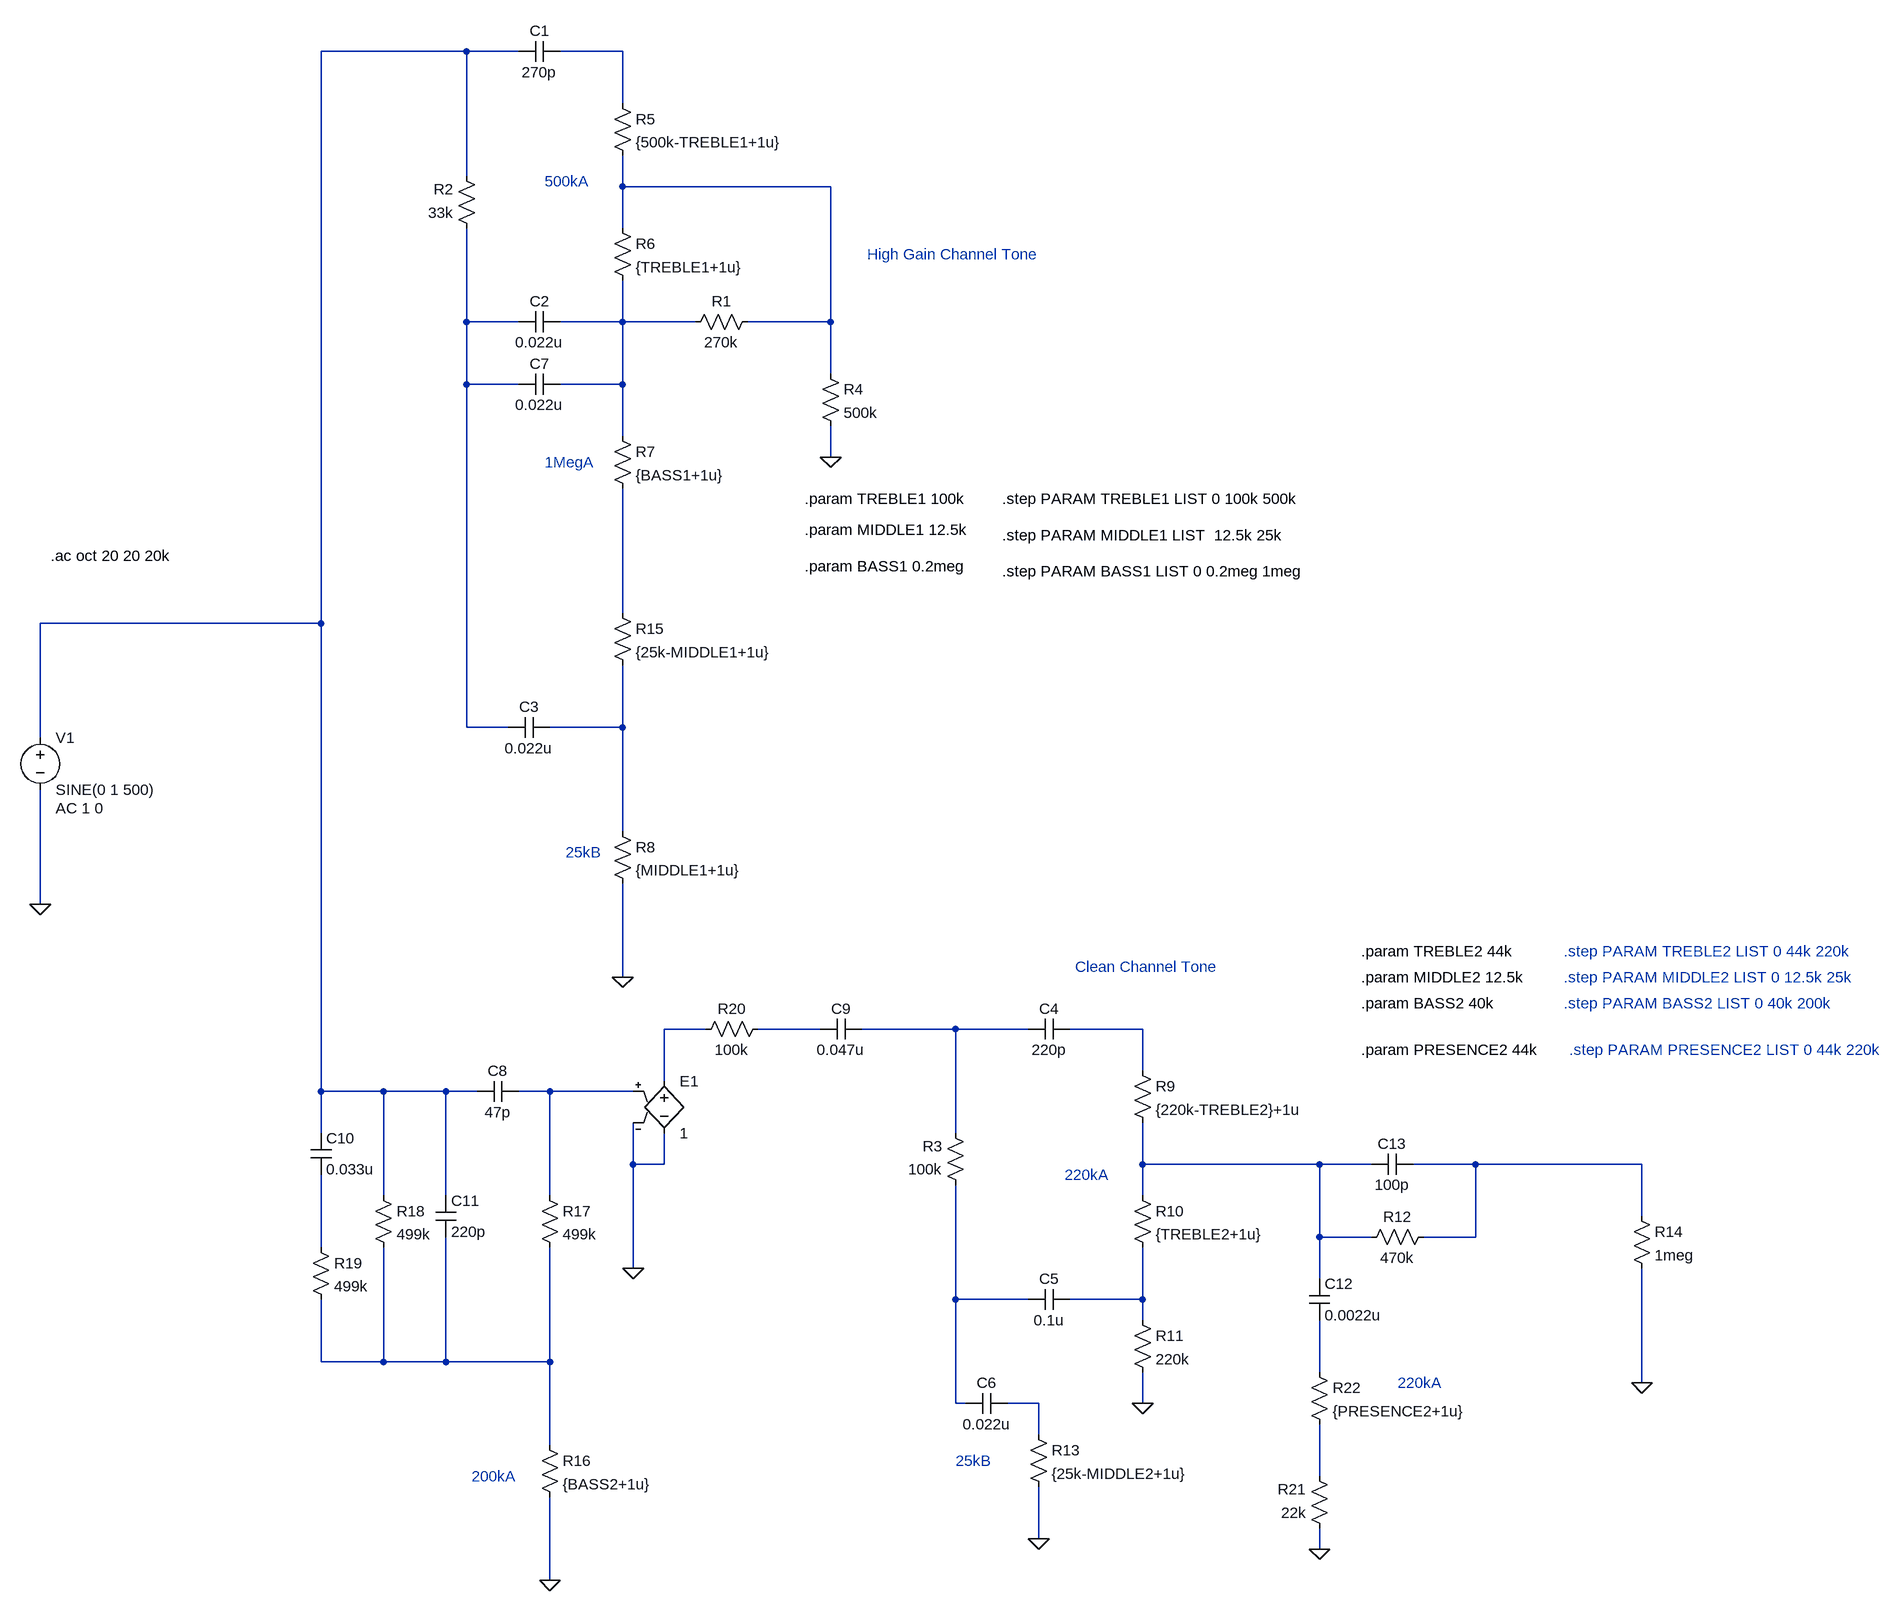
[diagram p0: schematic Bogner Ubershall Tone.asc]
Bogner Ubershall Tone.asc, the LTspice schematic file:
Version 4
SHEET 1 1312 2708
WIRE -1008 -928 -1232 -928
WIRE -928 -928 -1008 -928
WIRE -768 -928 -864 -928
WIRE -768 -848 -768 -928
WIRE -1008 -736 -1008 -928
WIRE -768 -720 -768 -768
WIRE -448 -720 -768 -720
WIRE -768 -656 -768 -720
WIRE -1008 -512 -1008 -656
WIRE -928 -512 -1008 -512
WIRE -768 -512 -768 -576
WIRE -768 -512 -864 -512
WIRE -656 -512 -768 -512
WIRE -448 -512 -448 -720
WIRE -448 -512 -576 -512
WIRE -448 -432 -448 -512
WIRE -1008 -416 -1008 -512
WIRE -928 -416 -1008 -416
WIRE -768 -416 -768 -512
WIRE -768 -416 -864 -416
WIRE -768 -336 -768 -416
WIRE -448 -304 -448 -352
WIRE -768 -64 -768 -256
WIRE -1232 -48 -1232 -928
WIRE -1232 -48 -1664 -48
WIRE -1008 112 -1008 -416
WIRE -944 112 -1008 112
WIRE -768 112 -768 16
WIRE -768 112 -880 112
WIRE -1664 128 -1664 -48
WIRE -768 272 -768 112
WIRE -1664 384 -1664 208
WIRE -768 496 -768 352
WIRE -640 576 -704 576
WIRE -464 576 -560 576
WIRE -256 576 -400 576
WIRE -144 576 -256 576
WIRE 32 576 -80 576
WIRE 32 640 32 576
WIRE -704 656 -704 576
WIRE -1232 672 -1232 -48
WIRE -1136 672 -1232 672
WIRE -1040 672 -1136 672
WIRE -992 672 -1040 672
WIRE -880 672 -928 672
WIRE -752 672 -880 672
WIRE -1232 736 -1232 672
WIRE -256 736 -256 576
WIRE -752 784 -752 720
WIRE -704 784 -704 736
WIRE -704 784 -752 784
WIRE 32 784 32 720
WIRE 304 784 32 784
WIRE 384 784 304 784
WIRE 544 784 448 784
WIRE 800 784 544 784
WIRE -1136 832 -1136 672
WIRE -1040 832 -1040 672
WIRE -880 832 -880 672
WIRE 32 832 32 784
WIRE 800 864 800 784
WIRE 304 896 304 784
WIRE 384 896 304 896
WIRE 544 896 544 784
WIRE 544 896 464 896
WIRE -1232 912 -1232 800
WIRE -752 944 -752 784
WIRE 304 960 304 896
WIRE -256 992 -256 816
WIRE -144 992 -256 992
WIRE 32 992 32 912
WIRE 32 992 -80 992
WIRE 32 1024 32 992
WIRE -1232 1088 -1232 992
WIRE -1136 1088 -1136 912
WIRE -1136 1088 -1232 1088
WIRE -1040 1088 -1040 896
WIRE -1040 1088 -1136 1088
WIRE -880 1088 -880 912
WIRE -880 1088 -1040 1088
WIRE 304 1104 304 1024
WIRE 800 1120 800 944
WIRE -256 1152 -256 992
WIRE -240 1152 -256 1152
WIRE -128 1152 -176 1152
WIRE 32 1152 32 1104
WIRE -128 1200 -128 1152
WIRE -880 1216 -880 1088
WIRE 304 1264 304 1184
WIRE -128 1360 -128 1280
WIRE 304 1376 304 1344
WIRE -880 1424 -880 1296
FLAG -768 496 0
FLAG -128 1360 0
FLAG -1664 384 0
FLAG -448 -304 0
FLAG 800 1120 0
FLAG -880 1424 0
FLAG -752 944 0
FLAG 32 1152 0
FLAG 304 1376 0
SYMBOL res -992 -640 R180
WINDOW 0 36 76 Left 2
WINDOW 3 36 40 Left 2
SYMATTR InstName R2
SYMATTR Value 33k
SYMBOL res -240 832 R180
WINDOW 0 36 76 Left 2
WINDOW 3 36 40 Left 2
SYMATTR InstName R3
SYMATTR Value 100k
SYMBOL res -464 -448 R0
SYMATTR InstName R4
SYMATTR Value 500k
SYMBOL res -784 -864 R0
SYMATTR InstName R5
SYMATTR Value {500k-TREBLE1+1u}
SYMBOL res -784 -672 R0
SYMATTR InstName R6
SYMATTR Value {TREBLE1+1u}
SYMBOL res -784 -352 R0
SYMATTR InstName R7
SYMATTR Value {BASS1+1u}
SYMBOL res -784 256 R0
SYMATTR InstName R8
SYMATTR Value {MIDDLE1+1u}
SYMBOL res 16 624 R0
SYMATTR InstName R9
SYMATTR Value {220k-TREBLE2}+1u
SYMBOL res 16 816 R0
SYMATTR InstName R10
SYMATTR Value {TREBLE2+1u}
SYMBOL res 16 1008 R0
SYMATTR InstName R11
SYMATTR Value 220k
SYMBOL res -144 1184 R0
SYMATTR InstName R13
SYMATTR Value {25k-MIDDLE2+1u}
SYMBOL res 784 848 R0
SYMATTR InstName R14
SYMATTR Value 1meg
SYMBOL voltage -1664 112 R0
WINDOW 123 24 124 Left 2
WINDOW 39 0 0 Left 2
SYMATTR Value2 AC 1 0
SYMATTR InstName V1
SYMATTR Value SINE(0 1 500)
SYMBOL cap -864 -944 R90
WINDOW 0 0 32 VBottom 2
WINDOW 3 32 32 VTop 2
SYMATTR InstName C1
SYMATTR Value 270p
SYMBOL cap -864 -528 R90
WINDOW 0 0 32 VBottom 2
WINDOW 3 32 32 VTop 2
SYMATTR InstName C2
SYMATTR Value 0.022u
SYMBOL cap -880 96 R90
WINDOW 0 0 32 VBottom 2
WINDOW 3 32 32 VTop 2
SYMATTR InstName C3
SYMATTR Value 0.022u
SYMBOL cap -80 560 R90
WINDOW 0 0 32 VBottom 2
WINDOW 3 32 32 VTop 2
SYMATTR InstName C4
SYMATTR Value 220p
SYMBOL cap -80 976 R90
WINDOW 0 0 32 VBottom 2
WINDOW 3 32 32 VTop 2
SYMATTR InstName C5
SYMATTR Value 0.1u
SYMBOL cap -176 1136 R90
WINDOW 0 0 32 VBottom 2
WINDOW 3 32 32 VTop 2
SYMATTR InstName C6
SYMATTR Value 0.022u
SYMBOL cap -864 -432 R90
WINDOW 0 0 32 VBottom 2
WINDOW 3 32 32 VTop 2
SYMATTR InstName C7
SYMATTR Value 0.022u
SYMBOL res -560 -528 R90
WINDOW 0 0 56 VBottom 2
WINDOW 3 32 56 VTop 2
SYMATTR InstName R1
SYMATTR Value 270k
SYMBOL res -784 -80 R0
SYMATTR InstName R15
SYMATTR Value {25k-MIDDLE1+1u}
SYMBOL res -896 1200 R0
SYMATTR InstName R16
SYMATTR Value {BASS2+1u}
SYMBOL cap -928 656 R90
WINDOW 0 0 32 VBottom 2
WINDOW 3 32 32 VTop 2
SYMATTR InstName C8
SYMATTR Value 47p
SYMBOL res -896 816 R0
SYMATTR InstName R17
SYMATTR Value 499k
SYMBOL res -1152 816 R0
SYMATTR InstName R18
SYMATTR Value 499k
SYMBOL res -1248 896 R0
SYMATTR InstName R19
SYMATTR Value 499k
SYMBOL cap -1248 736 R0
SYMATTR InstName C10
SYMATTR Value 0.033u
SYMBOL cap -1056 832 R0
SYMATTR InstName C11
SYMATTR Value 220p
SYMBOL res -544 560 R90
WINDOW 0 0 56 VBottom 2
WINDOW 3 32 56 VTop 2
SYMATTR InstName R20
SYMATTR Value 100k
SYMBOL e -704 640 R0
SYMATTR InstName E1
SYMATTR Value 1
SYMBOL cap -400 560 R90
WINDOW 0 0 32 VBottom 2
WINDOW 3 32 32 VTop 2
SYMATTR InstName C9
SYMATTR Value 0.047u
SYMBOL res 480 880 R90
WINDOW 0 0 56 VBottom 2
WINDOW 3 32 56 VTop 2
SYMATTR InstName R12
SYMATTR Value 470k
SYMBOL res 320 1360 R180
WINDOW 0 36 76 Left 2
WINDOW 3 36 40 Left 2
SYMATTR InstName R21
SYMATTR Value 22k
SYMBOL cap 288 960 R0
SYMATTR InstName C12
SYMATTR Value 0.0022u
SYMBOL cap 448 768 R90
WINDOW 0 0 32 VBottom 2
WINDOW 3 32 32 VTop 2
SYMATTR InstName C13
SYMATTR Value 100p
SYMBOL res 288 1088 R0
SYMATTR InstName R22
SYMATTR Value {PRESENCE2+1u}
TEXT -488 -240 Left 2 !.param TREBLE1 100k
TEXT 368 496 Left 2 !.param MIDDLE2 12.5k
TEXT 368 536 Left 2 !.param BASS2 40k
TEXT -1648 -152 Left 2 !.ac oct 20 20 20k
TEXT -488 -192 Left 2 !.param MIDDLE1 12.5k
TEXT -488 -136 Left 2 !.param BASS1 0.2meg
TEXT -184 -240 Left 2 !.step PARAM TREBLE1 LIST 0 100k 500k
TEXT 368 456 Left 2 !.param TREBLE2 44k
TEXT -184 -184 Left 2 !.step PARAM MIDDLE1 LIST  12.5k 25k
TEXT -184 -128 Left 2 !.step PARAM BASS1 LIST 0 0.2meg 1meg
TEXT -856 304 Left 2 ;25kB
TEXT -888 -296 Left 2 ;1MegA
TEXT -888 -728 Left 2 ;500kA
TEXT -392 -616 Left 2 ;High Gain Channel Tone
TEXT -1000 1264 Left 2 ;200kA
TEXT 680 536 Left 2 ;.step PARAM BASS2 LIST 0 40k 200k
TEXT -88 800 Left 2 ;220kA
TEXT 680 496 Left 2 ;.step PARAM MIDDLE2 LIST 0 12.5k 25k
TEXT 680 456 Left 2 ;.step PARAM TREBLE2 LIST 0 44k 220k
TEXT 368 608 Left 2 !.param PRESENCE2 44k
TEXT 688 608 Left 2 ;.step PARAM PRESENCE2 LIST 0 44k 220k
TEXT -72 480 Left 2 ;Clean Channel Tone
TEXT -256 1240 Left 2 ;25kB
TEXT 424 1120 Left 2 ;220kA

The netlist it stands for:
* Bogner Ubershall Tone.asc
R2 N004 N001 33k
R3 N016 N010 100k
R4 N003 0 500k
R5 N002 N003 {500k-TREBLE1+1u}
R6 N003 N005 {TREBLE1+1u}
R7 N005 N006 {BASS1+1u}
R8 N007 0 {MIDDLE1+1u}
R9 N011 N013 {220k-TREBLE2}+1u
R10 N013 N017 {TREBLE2+1u}
R11 N017 0 220k
R13 N020 0 {25k-MIDDLE2+1u}
R14 N014 0 1meg
V1 N001 0 SINE(0 1 500) AC 1 0
C1 N002 N001 270p
C2 N005 N004 0.022u
C3 N007 N004 0.022u
C4 N011 N010 220p
C5 N017 N016 0.1u
C6 N020 N016 0.022u
C7 N005 N004 0.022u
R1 N003 N005 270k
R15 N006 N007 {25k-MIDDLE1+1u}
R16 N018 0 {BASS2+1u}
C8 N012 N001 47p
R17 N012 N018 499k
R18 N001 N018 499k
R19 N015 N018 499k
C10 N001 N015 0.033u
C11 N001 N018 220p
R20 N009 N008 100k
E1 N008 0 N012 0 1
C9 N010 N009 0.047u
R12 N014 N013 470k
R21 0 N021 22k
C12 N013 N019 0.0022u
C13 N014 N013 100p
R22 N019 N021 {PRESENCE2+1u}
.param TREBLE1 100k
.param MIDDLE2 12.5k
.param BASS2 40k
.ac oct 20 20 20k
.param MIDDLE1 12.5k
.param BASS1 0.2meg
.step PARAM TREBLE1 LIST 0 100k 500k
.param TREBLE2 44k
.step PARAM MIDDLE1 LIST  12.5k 25k
.step PARAM BASS1 LIST 0 0.2meg 1meg
* 25kB
* 1MegA
* 500kA
* High Gain Channel Tone
* 200kA
* .step PARAM BASS2 LIST 0 40k 200k
* 220kA
* .step PARAM MIDDLE2 LIST 0 12.5k 25k
* .step PARAM TREBLE2 LIST 0 44k 220k
.param PRESENCE2 44k
* .step PARAM PRESENCE2 LIST 0 44k 220k
* Clean Channel Tone
* 25kB
* 220kA
.backanno
.end